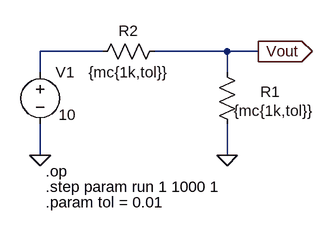
[diagram p0: schematic VoltageDividerMC.asc]
VoltageDividerMC.asc, the LTspice schematic file:
Version 4
SHEET 1 1220 680
WIRE 80 -160 -16 -160
WIRE 272 -160 160 -160
WIRE 320 -160 272 -160
WIRE -16 -128 -16 -160
WIRE 272 -128 272 -160
WIRE -16 0 -16 -48
WIRE 272 0 272 -48
FLAG -16 0 0
FLAG 272 0 0
FLAG 320 -160 Vout
IOPIN 320 -160 Out
SYMBOL res 176 -176 R90
WINDOW 0 0 56 VBottom 2
WINDOW 3 32 56 VTop 2
SYMATTR InstName R2
SYMATTR Value {mc{1k,tol}}
SYMATTR SpiceLine tol=5
SYMBOL voltage -16 -144 R0
WINDOW 3 28 81 Left 2
WINDOW 123 8 98 Left 2
WINDOW 39 0 0 Left 2
SYMATTR Value 10
SYMATTR InstName V1
SYMBOL res 288 -32 R180
WINDOW 0 -66 66 Left 2
WINDOW 3 -117 37 Left 2
SYMATTR InstName R1
SYMATTR Value {mc{1k,tol}}
TEXT -8 48 Left 2 !.step param run 1 1000 1
TEXT -8 72 Left 2 !.param tol = 0.01
TEXT -8 24 Left 2 !.op

The netlist it stands for:
* VoltageDividerMC.asc
R2 Vout N001 {mc{1k,tol}} tol=5
V1 N001 0 10
R1 0 Vout {mc{1k,tol}}
.step param run 1 1000 1
.param tol = 0.01
.op
.backanno
.end

* Results of the author's LTspice run, read from the files saved beside the schematic
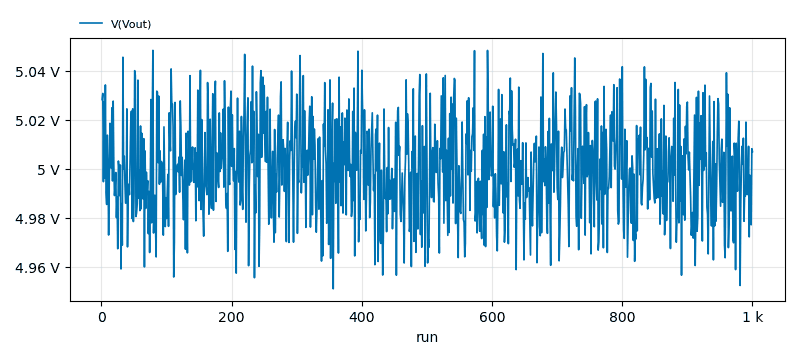
[diagram p1: Operating Point of VoltageDividerMC.asc, plotted from the saved traces]
* Operating Point, 1 run:
*   V(Vout): 5.028 V at run=1 , 5.007 V at run=1 k, min 4.951 V, max 5.048 V